# Altium schematic sheet DACs.SCHDOC
size B
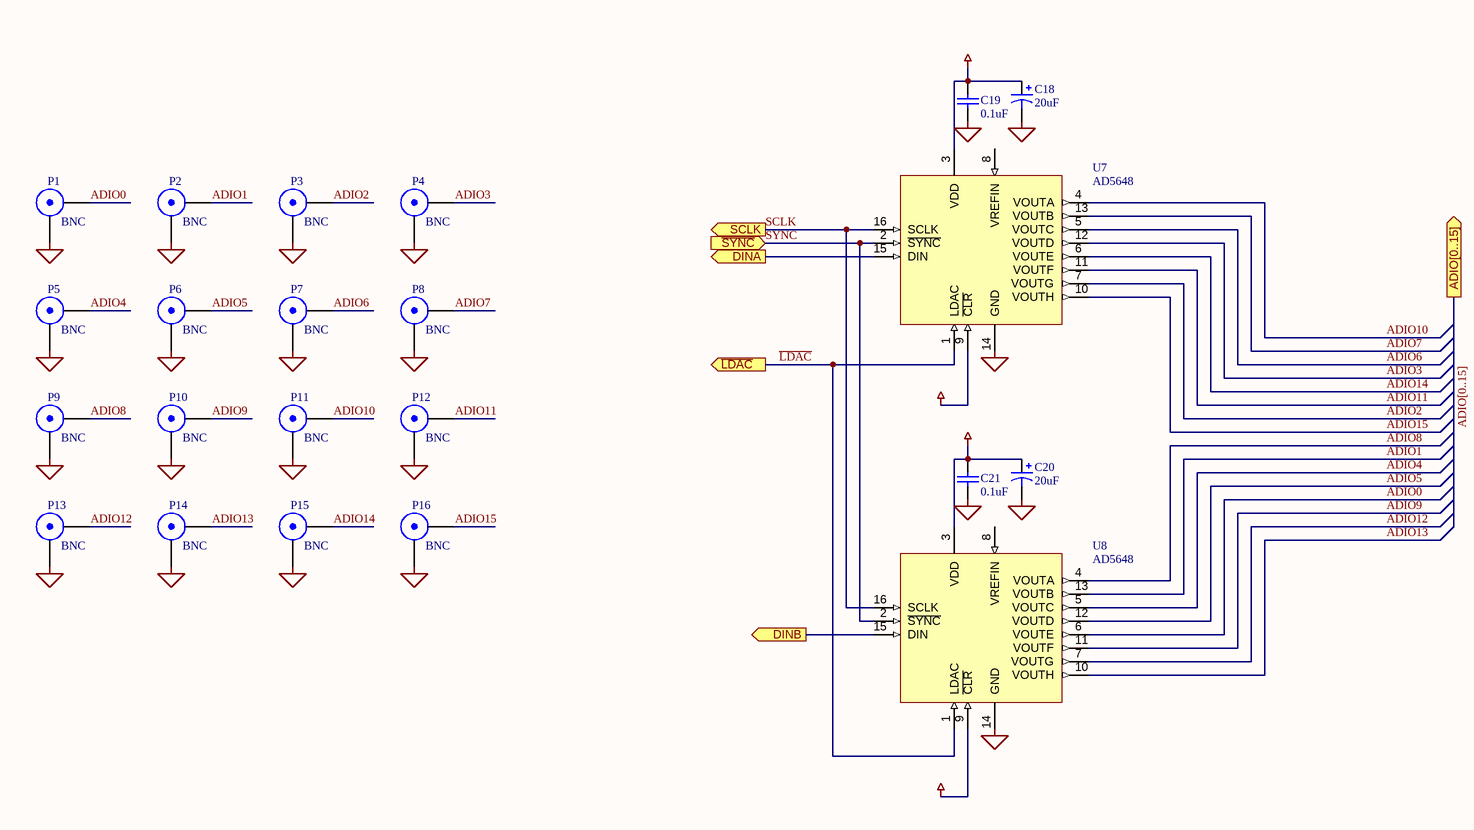
[diagram p0: DACs.SCHDOC]

## Parts
C18  value 20uF  [C]  (hidden comment: Cap Pol1)
C19  value 0.1uF  [CC1005-0402]  (hidden comment: Cap)
C20  value 20uF  [C]  (hidden comment: Cap Pol1)
C21  value 0.1uF  [CC1005-0402]  (hidden comment: Cap)
P1  BNC  [Vertical BNC 227699-1]
P2  BNC  [Vertical BNC 227699-1]
P3  BNC  [Vertical BNC 227699-1]
P4  BNC  [Vertical BNC 227699-1]
P5  BNC  [Vertical BNC 227699-1]
P6  BNC  [Vertical BNC 227699-1]
P7  BNC  [Vertical BNC 227699-1]
P8  BNC  [Vertical BNC 227699-1]
P9  BNC  [Vertical BNC 227699-1]
P10  BNC  [Vertical BNC 227699-1]
P11  BNC  [Vertical BNC 227699-1]
P12  BNC  [Vertical BNC 227699-1]
P13  BNC  [Vertical BNC 227699-1]
P14  BNC  [Vertical BNC 227699-1]
P15  BNC  [Vertical BNC 227699-1]
P16  BNC  [Vertical BNC 227699-1]
U7  AD5648  [TSSO5x6-G16]
U8  AD5648  [TSSO5x6-G16]

## Ports
ADIO[0..15] (out), DINA (out), DINB (out), SCLK (out), ~{LDAC} (out), ~{SYNC} (in)

## Nets
AGND: P1.2(Y) P2.2(Y) P3.2(Y) P4.2(Y) P5.2(Y) P6.2(Y) P7.2(Y) P8.2(Y) P9.2(Y) P10.2(Y) P11.2(Y) P12.2(Y) P13.2(Y) P14.2(Y) P15.2(Y) P16.2(Y)
AVDD: C18.1 C19.2 C20.1 C21.2 U7.3(VDD) U7.9(~{CLR}) U8.3(VDD) U8.9(~{CLR})
GND: C18.2 C19.1 C20.2 C21.1 U7.14(GND) U8.14(GND)
ADIO0: P1.1(X) U8.6(VOUTE)
ADIO1: P2.1(X) U8.13(VOUTB)
ADIO2: P3.1(X) U7.7(VOUTG)
ADIO3: P4.1(X) U7.12(VOUTD)
ADIO4: P5.1(X) U8.5(VOUTC)
ADIO5: P6.1(X) U8.12(VOUTD)
ADIO6: P7.1(X) U7.5(VOUTC)
ADIO7: P8.1(X) U7.13(VOUTB)
ADIO8: P9.1(X) U8.4(VOUTA)
ADIO9: P10.1(X) U8.11(VOUTF)
ADIO10: P11.1(X) U7.4(VOUTA)
ADIO11: P12.1(X) U7.11(VOUTF)
ADIO12: P13.1(X) U8.7(VOUTG)
ADIO13: P14.1(X) U8.10(VOUTH)
ADIO14: P15.1(X) U7.6(VOUTE)
ADIO15: P16.1(X) U7.10(VOUTH)
DINA: U7.15(DIN) ; port DINA
DINB: U8.15(DIN) ; port DINB
~{LDAC}: U7.1(LDAC) U8.1(LDAC) ; port ~{LDAC}
~{SYNC}: U7.2(~{SYNC}) U8.2(~{SYNC}) ; port ~{SYNC}
SCLK: U7.16(SCLK) U8.16(SCLK) ; port SCLK

Not connected (* = marked no-connect by the designer): U7 8(VREFIN); U8 8(VREFIN)

## Buses and harness runs
bus ADIO[0..15] = port ADIO[0..15]

## Notes on the sheet
- Title:
- Engineer:
- Date:
- Revision:
- Sheet
- of
- File:

## Library data of the parts
C18 C20 = Cap Pol1: Polarized Capacitor (Radial); Published: 8-Jun-2000; LatestRevisionDate: 17-Jul-2002; LatestRevisionNote: Re-released for DXP Platform.; Publisher: Altium Limited
C19 C21 = Cap: Capacitor; Manufacturer: Generic Components; Class I: Passive; Published: 8-Jun-2000; Revision: July-2002: Re-released for DXP Platform.; Publisher: Altium Limited; Class II: Capacitor
P1-P16 = BNC: BNC Elbow Connector; Manufacturer: Generic Components; Class II: RF Coaxial; Revision: July-2002: Re-released for DXP Platform.; Publisher: Altium Limited; Class I: Connector
U7 U8 = AD5648BRUZ-2: AD 14-bit DAC